# Altium schematic sheet DigitalIO.SchDoc
size A2; SheetNumber: 3; SheetTotal: 6
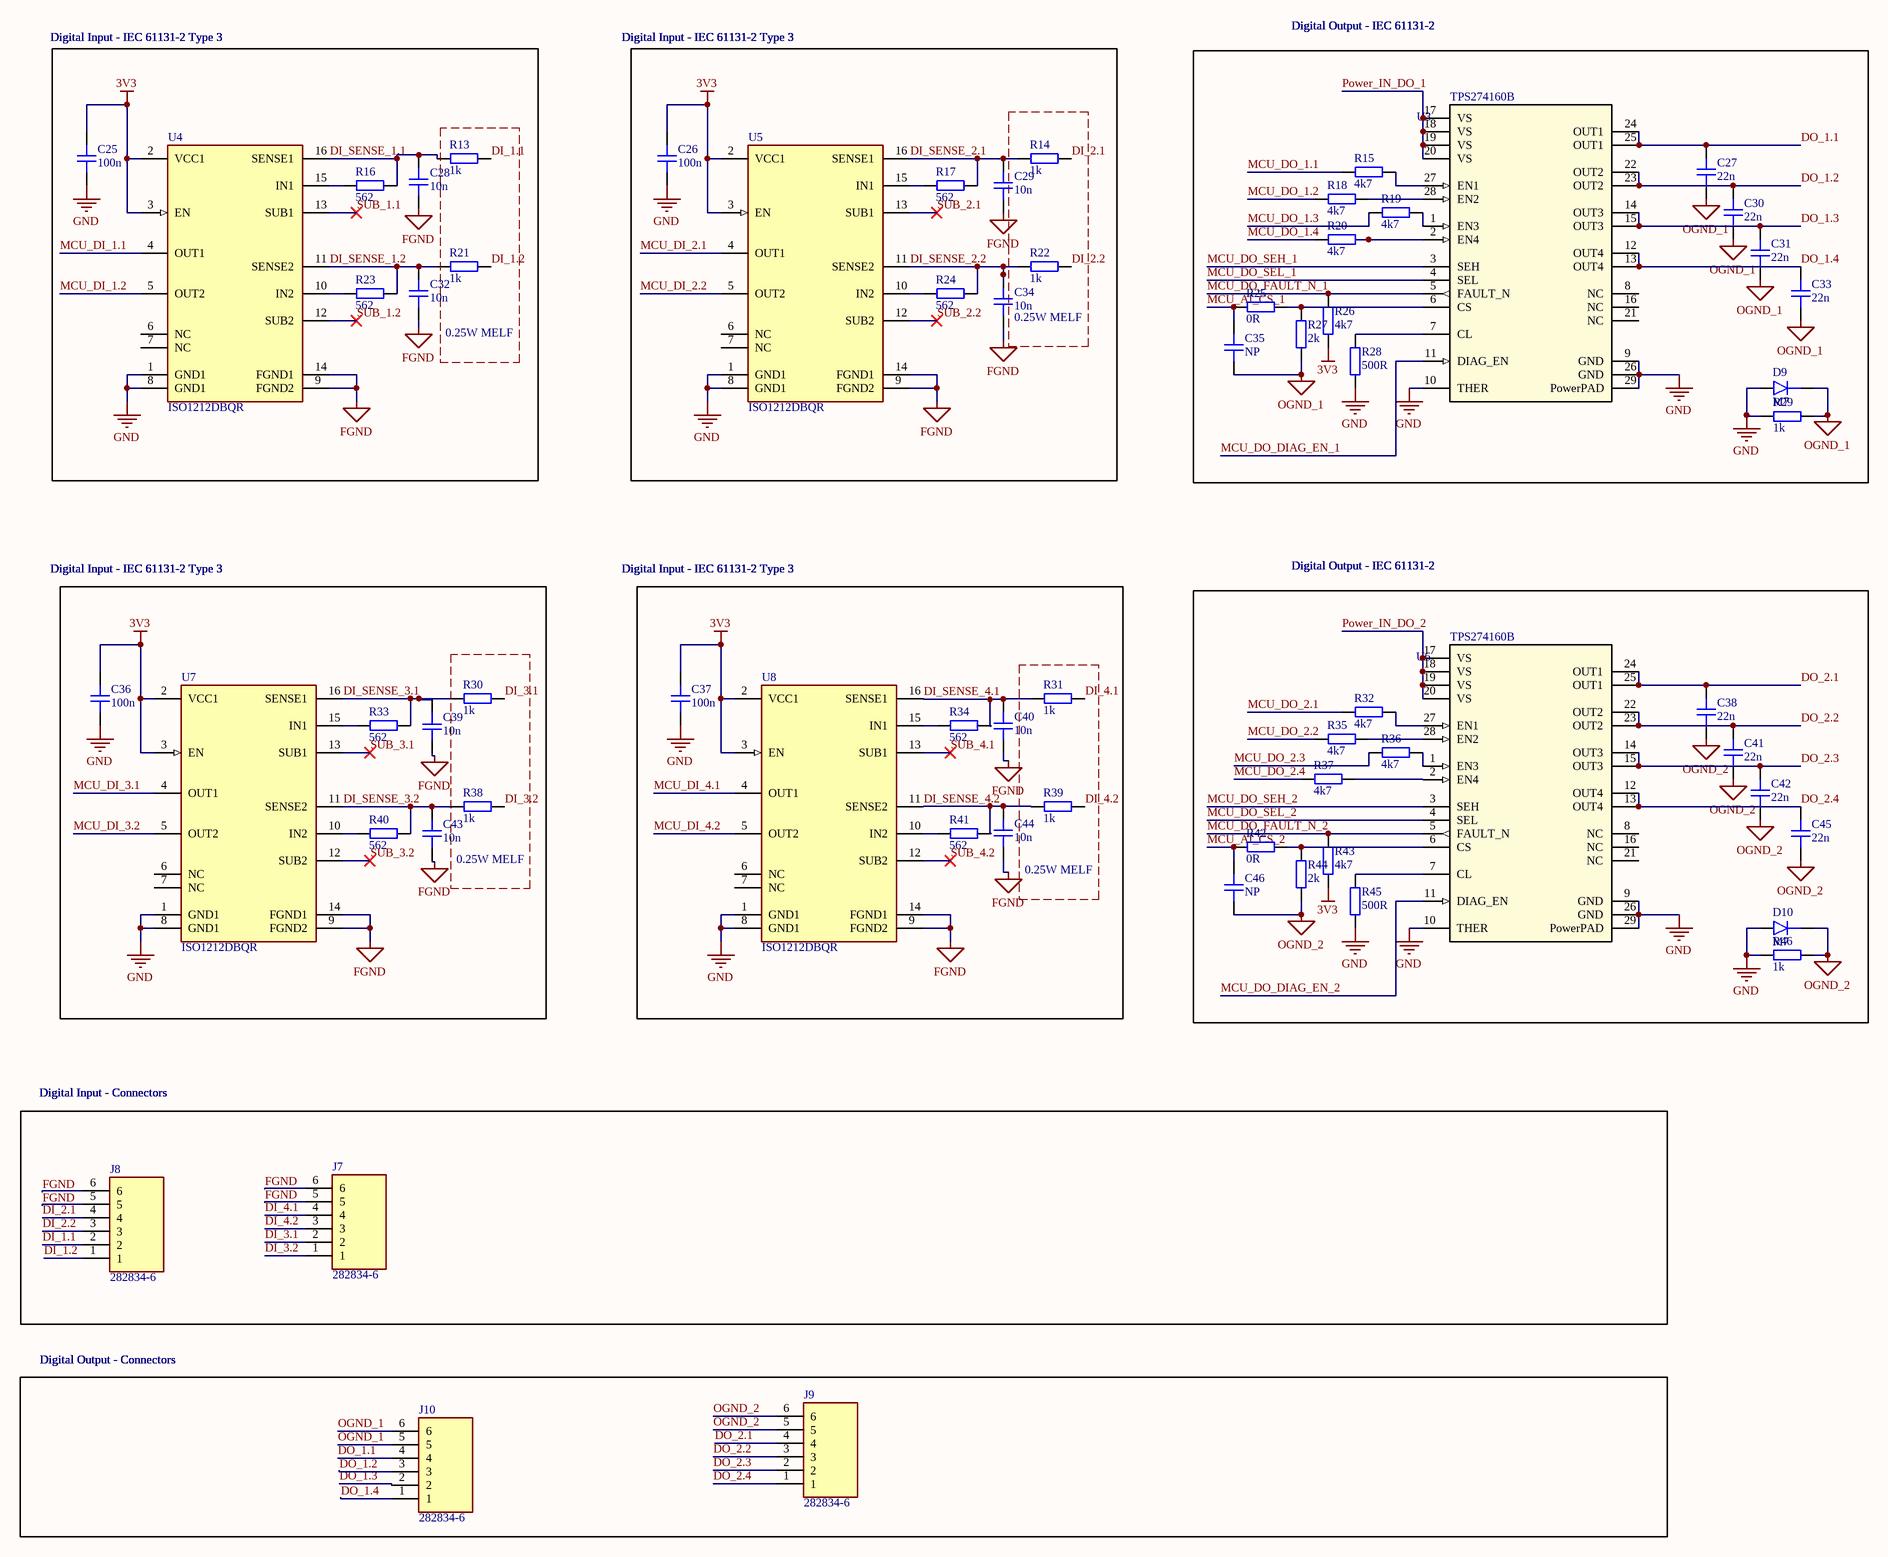
[diagram p0: DigitalIO.SchDoc]

## Parts
C25  100n  [CAP_0402]
C26  100n  [CAP_0402]
C27  22n  [CAP_0603]
C28  10n  [CAP_0603]
C29  10n  [CAP_0603]
C30  22n  [CAP_0603]
C31  22n  [CAP_0603]
C32  10n  [CAP_0603]
C33  22n  [CAP_0603]
C34  10n  [CAP_0603]
C35  NP  [CAP_0402]  (no BOM)
C36  100n  [CAP_0402]
C37  100n  [CAP_0402]
C38  22n  [CAP_0603]
C39  10n  [CAP_0603]
C40  10n  [CAP_0603]
C41  22n  [CAP_0603]
C42  22n  [CAP_0603]
C43  10n  [CAP_0603]
C44  10n  [CAP_0603]
C45  22n  [CAP_0603]
C46  NP  [CAP_0402]  (no BOM)
D9  M7  [DO-214AC-2 (SMA)]
D10  M7  [DO-214AC-2 (SMA)]
J7  282834-6  [TE_282834-6]
J8  282834-6  [TE_282834-6]
J9  282834-6  [TE_282834-6]
J10  282834-6  [TE_282834-6]
R13  1k  [FP-MMA0204-MFG]
R14  1k  [FP-MMA0204-MFG]
R15  4k7  [RES_0402]
R16  562  [RES_0402]
R17  562  [RES_0402]
R18  4k7  [RES_0402]
R19  4k7  [RES_0402]
R20  4k7  [RES_0402]
R21  1k  [FP-MMA0204-MFG]
R22  1k  [FP-MMA0204-MFG]
R23  562  [RES_0402]
R24  562  [RES_0402]
R25  0R  [RES_0402]
R26  4k7  [RES_0402]
R27  2k  [RES_0402]
R28  500R  [RES_0402]
R29  1k  [RES_1206]
R30  1k  [FP-MMA0204-MFG]
R31  1k  [FP-MMA0204-MFG]
R32  4k7  [RES_0402]
R33  562  [RES_0402]
R34  562  [RES_0402]
R35  4k7  [RES_0402]
R36  4k7  [RES_0402]
R37  4k7  [RES_0402]
R38  1k  [FP-MMA0204-MFG]
R39  1k  [FP-MMA0204-MFG]
R40  562  [RES_0402]
R41  562  [RES_0402]
R42  0R  [RES_0402]
R43  4k7  [RES_0402]
R44  2k  [RES_0402]
R45  500R  [RES_0402]
R46  1k  [RES_1206]
U3  TPS274160B  [RLH0028A-MFG]
U4  ISO1212DBQR  [FP-DBQ0016A-MFG]
U5  ISO1212DBQR  [FP-DBQ0016A-MFG]
U6  TPS274160B  [RLH0028A-MFG]
U7  ISO1212DBQR  [FP-DBQ0016A-MFG]
U8  ISO1212DBQR  [FP-DBQ0016A-MFG]

## Blocks framed on the sheet
0.25W MELF: R13 R21
0.25W MELF: R14 R22
0.25W MELF: R30 R38
0.25W MELF: R31 R39

## Nets
3V3: C25.2 C26.2 C36.2 C37.2 R26.2 R43.2 U4.2(VCC1) U4.3(EN) U5.2(VCC1) U5.3(EN) U7.2(VCC1) U7.3(EN) U8.2(VCC1) U8.3(EN)
FGND: C28.1 C29.1 C32.1 C34.1 C39.1 C40.1 C43.1 C44.1 J7.5 J7.6 J8.5 J8.6 U4.9(FGND2) U4.14(FGND1) U5.9(FGND2) U5.14(FGND1) U7.9(FGND2) U7.14(FGND1) U8.9(FGND2) U8.14(FGND1)
GND: C25.1 C26.1 C36.1 C37.1 D9.A D10.A R28.2 R29.1 R45.2 R46.1 U3.9(GND) U3.10(THER) U3.26(GND) U3.29(PowerPAD) U4.1(GND1) U4.8(GND1) U5.1(GND1) U5.8(GND1) U6.9(GND) U6.10(THER) U6.26(GND) U6.29(PowerPAD) U7.1(GND1) U7.8(GND1) U8.1(GND1) U8.8(GND1)
OGND_1: C27.1 C30.1 C31.1 C33.1 C35.1 D9.K J10.5 J10.6 R27.2 R29.2
OGND_2: C38.1 C41.1 C42.1 C45.1 C46.1 D10.K J9.5 J9.6 R44.2 R46.2
DI_1.1: J8.2 R13.1
DI_1.2: J8.1 R21.1
DI_2.1: J8.4 R14.1
DI_2.2: J8.3 R22.1
DI_3.1: J7.2 R30.1
DI_3.2: J7.1 R38.1
DI_4.1: J7.4 R31.1
DI_4.2: J7.3 R39.1
DI_SENSE_1.1: C28.2 R13.2 R16.1 U4.16(SENSE1)
DI_SENSE_1.2: C32.2 R21.2 R23.1 U4.11(SENSE2)
DI_SENSE_2.1: C29.2 R14.2 R17.1 U5.16(SENSE1)
DI_SENSE_2.2: C34.2 R22.2 R24.1 U5.11(SENSE2)
DI_SENSE_3.1: C39.2 R30.2 R33.1 U7.16(SENSE1)
DI_SENSE_3.2: C43.2 R38.2 R40.1 U7.11(SENSE2)
DI_SENSE_4.1: C40.2 R31.2 R34.1 U8.16(SENSE1)
DI_SENSE_4.2: C44.2 R39.2 R41.1 U8.11(SENSE2)
DO_1.1: C27.2 J10.4 U3.24(OUT1) U3.25(OUT1)
DO_1.2: C30.2 J10.3 U3.22(OUT2) U3.23(OUT2)
DO_1.3: C31.2 J10.2 U3.14(OUT3) U3.15(OUT3)
DO_1.4: C33.2 J10.1 U3.12(OUT4) U3.13(OUT4)
DO_2.1: C38.2 J9.4 U6.24(OUT1) U6.25(OUT1)
DO_2.2: C41.2 J9.3 U6.22(OUT2) U6.23(OUT2)
DO_2.3: C42.2 J9.2 U6.14(OUT3) U6.15(OUT3)
DO_2.4: C45.2 J9.1 U6.12(OUT4) U6.13(OUT4)
MCU_AI_CS_1: C35.2 R25.1
MCU_AI_CS_2: C46.2 R42.1
MCU_DI_1.1: U4.4(OUT1)
MCU_DI_1.2: U4.5(OUT2)
MCU_DI_2.1: U5.4(OUT1)
MCU_DI_2.2: U5.5(OUT2)
MCU_DI_3.1: U7.4(OUT1)
MCU_DI_3.2: U7.5(OUT2)
MCU_DI_4.1: U8.4(OUT1)
MCU_DI_4.2: U8.5(OUT2)
MCU_DO_1.1: R15.2
MCU_DO_1.2: R18.2
MCU_DO_1.3: R19.2
MCU_DO_1.4: R20.2
MCU_DO_2.1: R32.2
MCU_DO_2.2: R35.2
MCU_DO_2.3: R36.2
MCU_DO_2.4: R37.2
MCU_DO_DIAG_EN_1: U3.11(DIAG_EN)
MCU_DO_DIAG_EN_2: U6.11(DIAG_EN)
MCU_DO_FAULT_N_1: R26.1 U3.5(FAULT_N)
MCU_DO_FAULT_N_2: R43.1 U6.5(FAULT_N)
MCU_DO_SEH_1: U3.3(SEH)
MCU_DO_SEH_2: U6.3(SEH)
MCU_DO_SEL_1: U3.4(SEL)
MCU_DO_SEL_2: U6.4(SEL)
Power_IN_DO_1: U3.17(VS) U3.18(VS) U3.19(VS) U3.20(VS)
Power_IN_DO_2: U6.17(VS) U6.18(VS) U6.19(VS) U6.20(VS)
SUB_1.1: U4.13(SUB1)
SUB_1.2: U4.12(SUB2)
SUB_2.1: U5.13(SUB1)
SUB_2.2: U5.12(SUB2)
SUB_3.1: U7.13(SUB1)
SUB_3.2: U7.12(SUB2)
SUB_4.1: U8.13(SUB1)
SUB_4.2: U8.12(SUB2)
NetR15_1: R15.1 U3.27(EN1)
NetR16_2: R16.2 U4.15(IN1)
NetR17_2: R17.2 U5.15(IN1)
NetR18_1: R18.1 U3.28(EN2)
NetR19_1: R19.1 U3.1(EN3)
NetR20_1: R20.1 U3.2(EN4)
NetR23_2: R23.2 U4.10(IN2)
NetR24_2: R24.2 U5.10(IN2)
NetR25_2: R25.2 R27.1 U3.6(CS)
NetR28_1: R28.1 U3.7(CL)
NetR32_1: R32.1 U6.27(EN1)
NetR33_2: R33.2 U7.15(IN1)
NetR34_2: R34.2 U8.15(IN1)
NetR35_1: R35.1 U6.28(EN2)
NetR36_1: R36.1 U6.1(EN3)
NetR37_1: R37.1 U6.2(EN4)
NetR40_2: R40.2 U7.10(IN2)
NetR41_2: R41.2 U8.10(IN2)
NetR42_2: R42.2 R44.1 U6.6(CS)
NetR45_1: R45.1 U6.7(CL)

Not connected (* = marked no-connect by the designer): U3 8(NC) 16(NC) 21(NC); U4 6(NC) 7(NC); U5 6(NC) 7(NC); U6 8(NC) 16(NC) 21(NC); U7 6(NC) 7(NC); U8 6(NC) 7(NC)

## Notes on the sheet
- Digital Input - IEC 61131-2 Type 3
- Digital Output - IEC 61131-2
- Digital Input - Connectors
- Digital Output - Connectors

## Library data of the parts
C25 C26 C35-C37 C46 = CAP_0402: Capacitor SMD 0402; Manufacturer: *; Manufacturer Part Number: *; Distributor Link: *; LCSC: *; Rating: *; Dielectric: *
C27-C34 C38-C45 = CAP_0603: Capacitor SMD 0603; Manufacturer: *; Manufacturer Part Number: *; Distributor Link: *; LCSC: *; Rating: *; Dielectric: *
D9 D10 = D_SMA: Diode SMD SMA (DO-214AA)
J7-J10 = CMP-035-000000-2: Connector - 6 Points; MF: {'manufacturer': 'TE Connectivity'}; Availability: Unavailable; Design Item ID: 282834-6; Pin Count: 6; Package: None; Price: None; MP: 282834-6; Component Type: Standard; Source: 282834-6.SchLib; Value: *
R13 R14 R21 R22 R30 R31 R38 R39 = RES_1206: Resistor SMD 1206; Manufacturer: *; Manufacturer Part Number: *; Distributor Link: *; LCSC: *
R15-R20 R23-R28 R32-R37 R40-R45 = RES_0402: Resistor SMD 0402; Manufacturer: *; Manufacturer Part Number: *; Distributor Link: *; LCSC: *
R29 R46 = RES_1206: Resistor SMD 1206 nonMELF; Manufacturer: *; Manufacturer Part Number: *; Distributor Link: *; LCSC: *
U3 U6 = PTPS274160ARLHR: No Description Available; Mfr_Name: Texas Instruments; Type: DEV; RefDes: RefDes; Copyright: Copyright (C) 2023 Ultra Librarian. All rights reserved.; Manufacturer_Part_Number: PTPS274160ARLHR
U4 U5 U7 U8 = CMP-04872-000004-1: ISOLATED 24-V TO 60-V DIGITAL IN; Manufacturer: Texas Instruments; Standoff Height: 0.11mm; Max Supply Voltage: 5.5V; Min Supply Voltage: 2.25V; Nominal Supply Current: 194-389mA; Max Junction Temp: +150°C; ComponentLink2URL: http://www.ti.com/lit/ds/symlink/iso1212.pdf; Device Class L1: Integrated Circuits (ICs); Octopart: https://octopart.com/iso1212dbqr-texas+instruments-84619664; Ipc Land Pattern Name: SOP64P600X175-16; Ambient Temperature Range High: +125°C; Automotive: No; Temperature Range High: +125°C; Manufacturer Part Number: ISO1212DBQR; Package: DBQ0016A; Lead Free: Yes; RoHS: TRUE; Device Class L3: unset; Digikey Description: ISOLATED 24-V TO 60-V DIGITAL IN; ComponentLink2Description: Datasheet; Height: 1.75mm; Device Class L2: Interface ICs; Temperature Range Low: -55°C; Ambient Temperature Range Low: -40°C; Category: IC; Temperature: -55°C to +125°C